# EAGLE design switch (EAGLE 6.6.0)
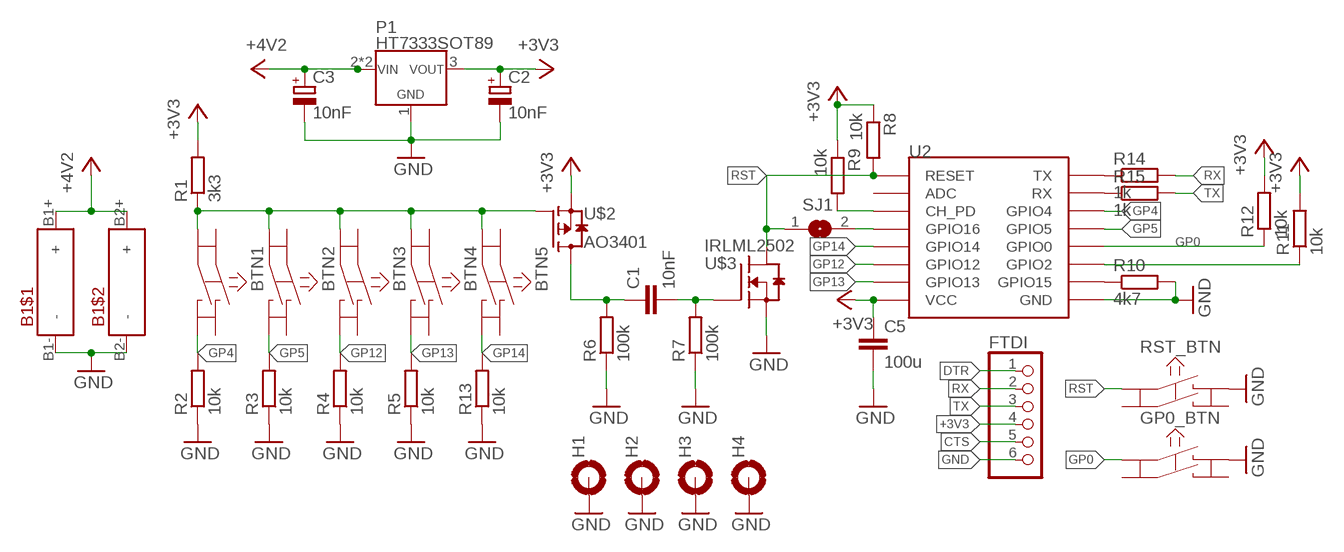
[diagram p0: schematic, sheet 1]

## Parts
B1  18650_2X  [18650_HOLDER]
BTN1  KSM611A  [KSM611A]
BTN2  KSM611A  [KSM611A]
BTN3  KSM611A  [KSM611A]
BTN4  KSM611A  [KSM611A]
BTN5  KSM611A  [KSM611A]
C1  10nF  C-EU025-025X050  [C025-025X050]
C2  10nF  CPOL-EUE5-8.5  [E5-8,5]
C3  10nF  CPOL-EUE5-8.5  [E5-8,5]
C5  100u  C-EUC1206  [C1206]
FTDI  PINHD-1X06_2.54-S  [1X06-S]
GP0_BTN  KSM611A  [KSM611A]
H1  MOUNT-PAD-ROUND3.2  [3,2-PAD]
H2  MOUNT-PAD-ROUND3.2  [3,2-PAD]
H3  MOUNT-PAD-ROUND3.2  [3,2-PAD]
H4  MOUNT-PAD-ROUND3.2  [3,2-PAD]
P1  HT7333SOT89  [SOT89]
R1  3k3  R-EU_MULTI  [MULTI_RESISTOR]
R2  10k  R-EU_MULTI  [MULTI_RESISTOR]
R3  10k  R-EU_MULTI  [MULTI_RESISTOR]
R4  10k  R-EU_MULTI  [MULTI_RESISTOR]
R5  10k  R-EU_MULTI  [MULTI_RESISTOR]
R6  100k  R-EU_MULTI  [MULTI_RESISTOR]
R7  100k  R-EU_MULTI  [MULTI_RESISTOR]
R8  10k  R-EU_MULTI  [MULTI_RESISTOR]
R9  10k  R-EU_MULTI  [MULTI_RESISTOR]
R10  4k7  R-EU_MULTI  [MULTI_RESISTOR]
R11  10k  R-EU_MULTI  [MULTI_RESISTOR]
R12  10k  R-EU_MULTI  [MULTI_RESISTOR]
R13  10k  R-EU_MULTI  [MULTI_RESISTOR]
R14  1k  R-EU_MULTI  [MULTI_RESISTOR]
R15  1k  R-EU_MULTI  [MULTI_RESISTOR]
RST_BTN  KSM611A  [KSM611A]
SJ1  SJ  [SJ]
U2  ESP12SMD  [ESP12-SMD]
U$2  AO3401  P-CH_AO3401  [SOT23]
U$3  IRLML2502  N-CH_IRLML2502  [SOT23]

## Nets
+3V3: C2.+ C5.1 FTDI.4 P1.3(VOUT) R1.2@1 R1.2@2 R8.1@1 R8.1@2 R9.1@1 R9.1@2 R11.2@1 R11.2@2 R12.2@1 R12.2@2 U2.VCC U$2.2(S)
+5V: B1.B1+($1:+) B1.B2+($2:+) C3.+ P1.2(VIN) P1.2@1(VIN) ; supply symbol labelled +4V2
CTS: FTDI.5
DTR: FTDI.1
GND: B1.B1-($1:-) B1.B2-($2:-) C2.- C3.- C5.2 FTDI.6 GP0_BTN.B H1.B3,2(MOUNT) H2.B3,2(MOUNT) H3.B3,2(MOUNT) H4.B3,2(MOUNT) P1.1(GND) R2.1@1 R2.1@2 R3.1@1 R3.1@2 R4.1@1 R4.1@2 R5.1@1 R5.1@2 R6.1@1 R6.1@2 R7.1@1 R7.1@2 R10.2@1 R10.2@2 R13.1@1 R13.1@2 RST_BTN.B U2.GND U$3.2(S)
GP0: GP0_BTN.A R12.1@1 R12.1@2 U2.GPIO0
GP4: BTN1.D R2.2@1 R2.2@2 U2.GPIO4
GP5: BTN2.D R3.2@1 R3.2@2 U2.GPIO5
GP12: BTN3.D R4.2@1 R4.2@2 U2.GPIO12
GP13: BTN4.D R5.2@1 R5.2@2 U2.GPIO13
GP14: BTN5.D R13.2@1 R13.2@2 U2.GPIO14
N$1: SJ1.2 U2.GPIO16
N$2: R9.2@1 R9.2@2 U2.CH_PD
N$3: C1.2 R7.2@1 R7.2@2 U$3.1(G)
N$4: R10.1@1 R10.1@2 U2.GPIO15
N$5: R11.1@1 R11.1@2 U2.GPIO2
N$6: R14.1@1 R14.1@2 U2.TXD0(TX)
N$7: C1.1 R6.2@1 R6.2@2 U$2.3(D)
N$8: BTN1.C BTN2.C BTN3.C BTN4.C BTN5.C R1.1@1 R1.1@2 U$2.1(G)
N$9: R15.1@1 R15.1@2 U2.RXD0(RX)
RST: R8.2@1 R8.2@2 RST_BTN.A SJ1.1 U2.RESET U$3.3(D)
RX: FTDI.2 R14.2@1 R14.2@2
TX: FTDI.3 R15.2@1 R15.2@2
Unconnected: BTN1.A BTN1.B BTN2.A BTN2.B BTN3.A BTN3.B BTN4.A BTN4.B BTN5.A BTN5.B GP0_BTN.C GP0_BTN.D RST_BTN.C RST_BTN.D U2.ADC

## Library data of the parts
B1 = diyHue:18650_2X
BTN1-BTN5 GP0_BTN RST_BTN = schalter_taster:KSM611A
C1 C5 = rcl:C-EU: CAPACITOR, European symbol
C2 C3 = rcl:CPOL-EU: POLARIZED CAPACITOR, European symbol
FTDI = pinhead-2:PINHD-1X06: PIN HEADER
H1-H4 = holes:MOUNT-PAD-ROUND: MOUNTING PAD, round
P1 = diyHue:HT7333
R1-R15 = diyHue:R-EU_MULTI
SJ1 = jumper:SJ: SMD solder JUMPER
U2 = esp8266modules:ESP12: ESP8266 Wifi module 12
U$2 = diyHue:P-CH_AO3401
U$3 = diyHue:N-CH_IRLML2502

## Board
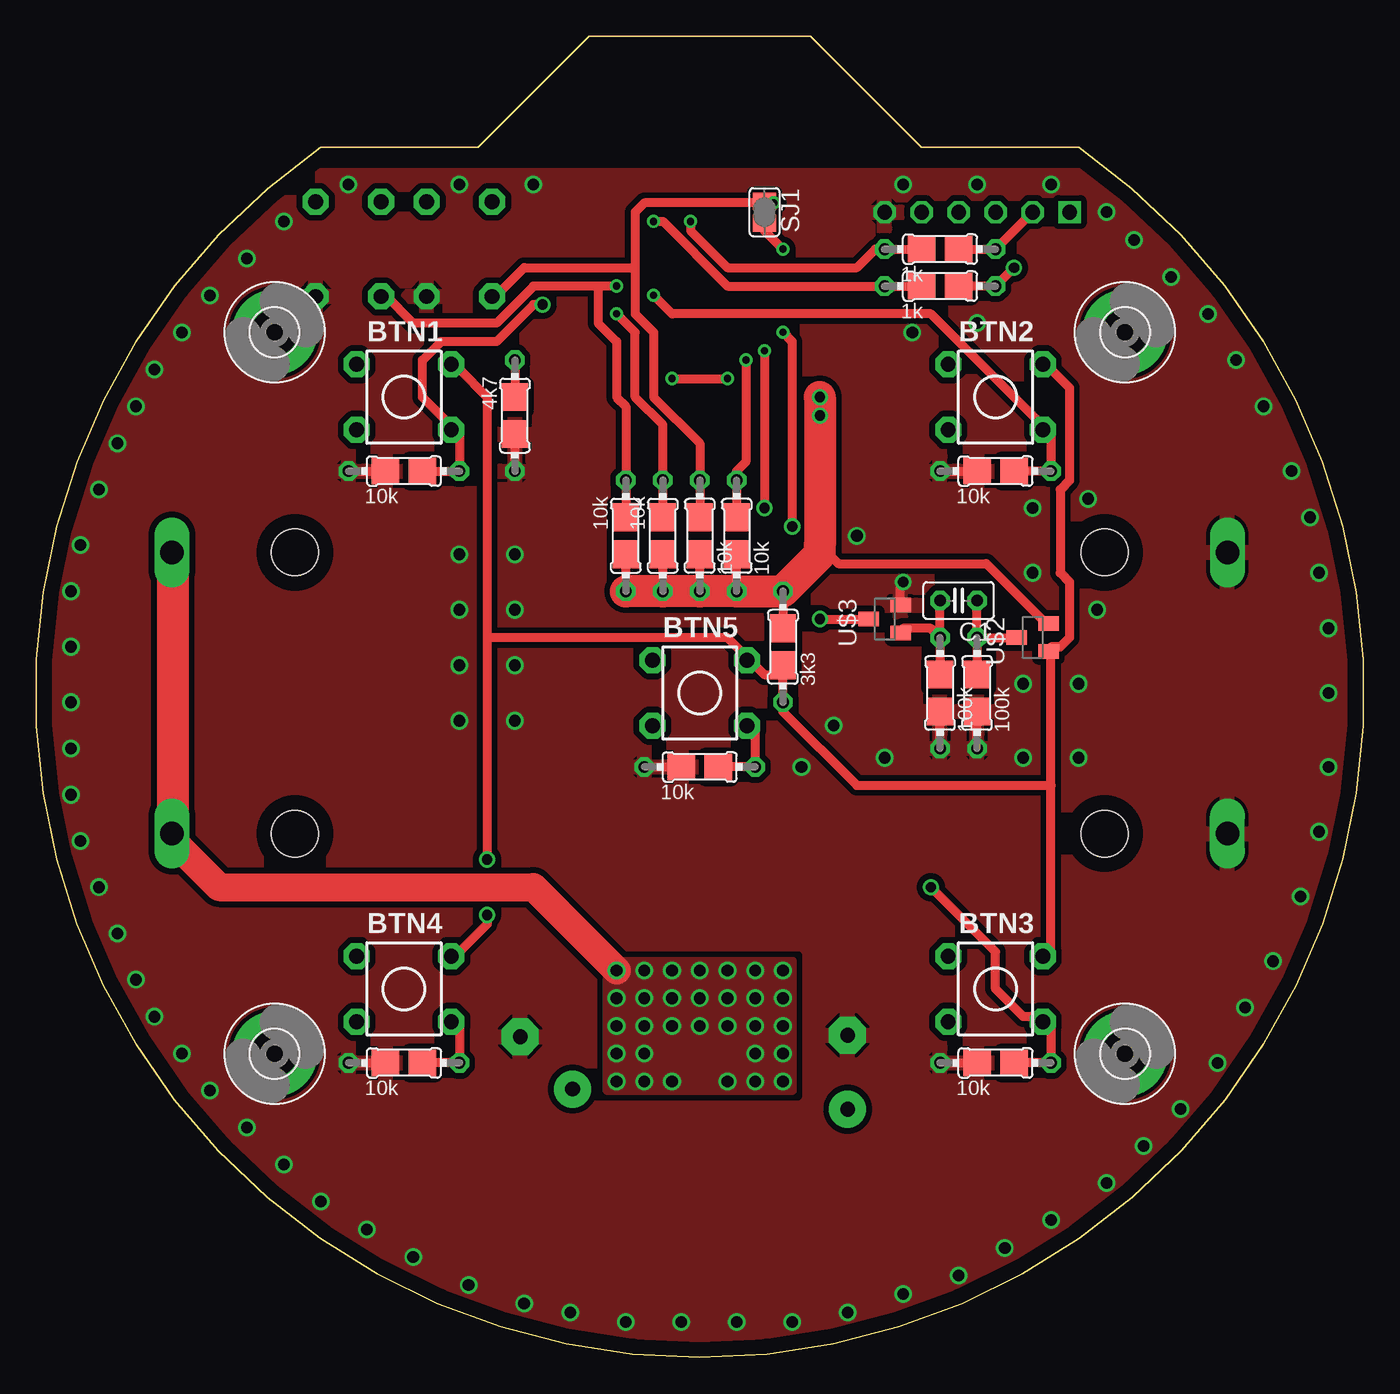
[diagram p1: board, top side]
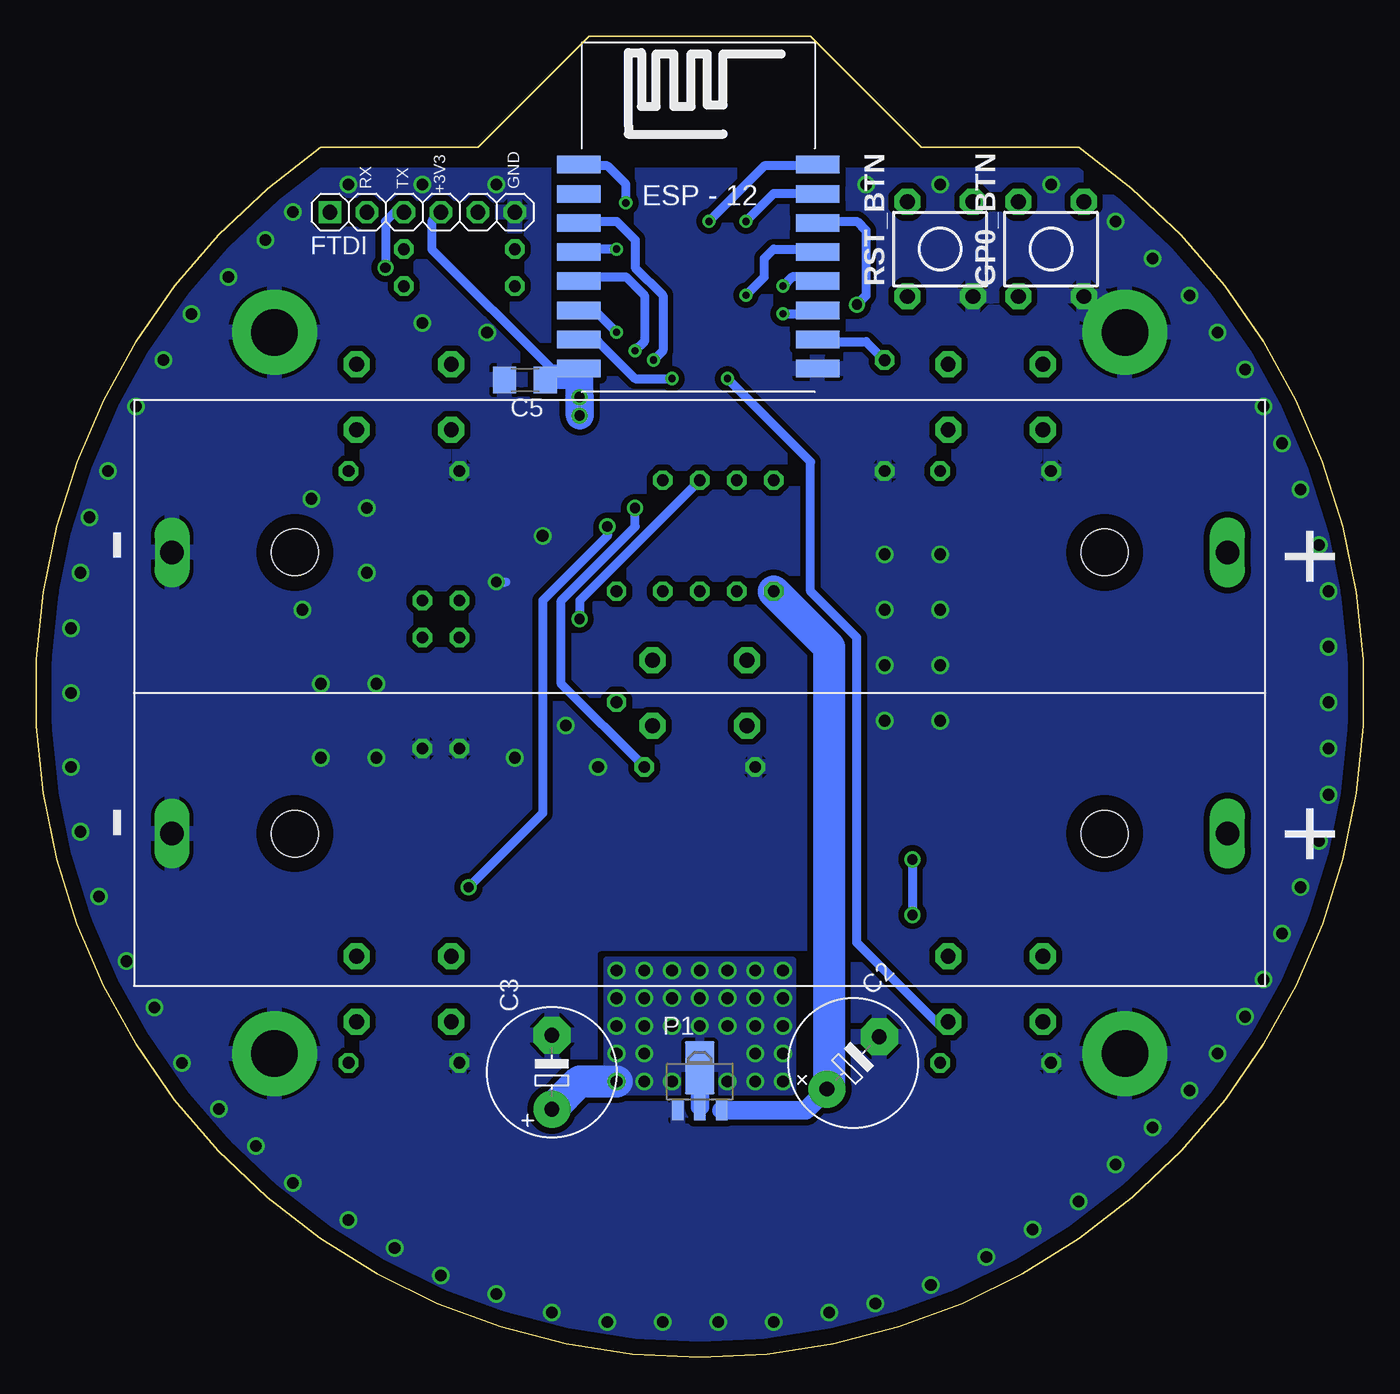
[diagram p2: board, bottom side, seen from below]

Size 91.13 x 90.71 mm. Coordinates in mm from the lower left corner, seen from the top.
Outline: 19.53,83.09 arc290 71.6,83.09 60.81,83.09 53.19,90.71 37.95,90.71 30.33,83.09 19.53,83.09
Copper layers (1*16): Top 0.035mm / dielectric 1.5mm / Bottom 0.035mm
Design rules "default *": minimum track width 10mil, minimum drill 0.5mm, track to track 8mil, track to pad 8mil, pad to pad 8mil, via to via 8mil, smd to smd 0mil, copper to edge 40mil, drill to drill 8mil, minimum pad ring 10mil, minimum via ring 8mil, stop-mask expansion 4mil, vias tented up to drill 50mil, thermal gap 10mil

### Footprints (pad centres in the part's own frame; a part is rotated, then mirrored left to right if it is on the bottom)
18650_HOLDER = drill 1.6 long: B1+ 36.25,9.65; B1- -36.25,9.65; B2+ 36.25,-9.65; B2- -36.25,-9.65 | hole 3.2: -27.81,9.65; 27.81,9.65; 27.81,-9.65; -27.81,-9.65
KSM611A = drill 1.016 pad 1.778 octagon: A -3.25,2.25; B -3.25,-2.25; C 3.25,2.25; D 3.25,-2.25
C025-025X050 = drill 0.813 octagon: 1 -1.27,0; 2 1.27,0
E5-8,5 = drill 1.016 pad 2.54: + -2.54,0 | drill 1.016 pad 2.54 octagon: - 2.54,0
C1206 = smd 1.6 x 1.8: 1 -1.4,0; 2 1.4,0
1X06-S = drill 1.016 square: 1 -6.35,0 | drill 1.016 octagon: 2 -3.81,0; 3 -1.27,0; 4 1.27,0; 5 3.81,0; 6 6.35,0
3,2-PAD = drill 3.2 pad 5.842: B3,2 0,0
SOT89 = smd 0.8 x 1.4: 1 -1.499,-1.981; 3 1.499,-1.981 | smd 0.8 x 1.9: 2 0,-1.727 | smd 2.032 x 3.65: 2@1 0,0.94
MULTI_RESISTOR = drill 0.813 octagon: 1@1 -3.81,0; 2@1 3.81,0 | smd 1.905 x 1.803: 1@2 -1.266,0; 2@2 1.266,0
SJ = smd 1.168 x 1.6: 1 -0.762,0; 2 0.762,0
ESP12-SMD = smd 3 x 1.2: ADC -8.3,3.8; CH_PD -8.3,1.8; GND 8.1,-8.2; GPIO0 8.1,-2.2; GPIO2 8.1,-4.2; GPIO4 8.1,1.8; GPIO5 8.1,-0.2; GPIO12 -8.3,-4.2; GPIO13 -8.3,-6.2; GPIO14 -8.3,-2.2; GPIO15 8.1,-6.2; GPIO16 -8.3,-0.2; RESET -8.3,5.8; RXD0 8.1,3.8; TXD0 8.1,5.8; VCC -8.3,-8.2
SOT23 = smd 1 x 1.4: 1 -0.95,-1.1; 2 0.95,-1.1; 3 0,1.1

### Placement (x,y rotation side)
B1  45.57,45.62 0 bottom
BTN1  25.25,65.94 0 top
BTN2  65.89,65.94 0 top
BTN3  65.89,25.3 0 top
BTN4  25.25,25.3 0 top
BTN5  45.57,45.62 0 top
C1  63.35,51.97 180 top
C2  35.03,20.22 45 bottom
C3  55.73,19.59 90 bottom
C5  57.57,67.12 180 bottom
FTDI  64.62,78.64 0 bottom
GP0_BTN  21.44,76.1 90 bottom
H1  16.36,20.86 0 top
H2  74.78,20.86 0 top
H3  74.78,70.39 0 top
H4  16.36,70.39 0 top
P1  45.57,18.95 0 bottom
R1  51.28,48.8 90 top
R2  25.25,60.86 0 top
R3  65.89,60.86 0 top
R4  65.89,20.22 0 top
R5  25.25,20.22 0 top
R6  64.62,45.62 90 top
R7  62.08,45.62 90 top
R8  45.57,56.42 90 top
R9  48.11,56.42 90 top
R10  32.87,64.67 270 top
R11  43.03,56.42 270 top
R12  40.49,56.42 270 top
R13  45.57,40.54 0 top
R14  62.08,76.1 0 top
R15  62.08,73.56 0 top
RST_BTN  29.06,76.1 90 bottom
SJ1  50.01,78.64 270 top
U2  45.57,76.1 0 bottom
U$2  68.43,49.43 90 top
U$3  58.27,50.7 90 top

### Tracks (layer width: path | path; a pad name or v marks a point on that pad's centre or on a via)
+3V3  (via drill 0.7)
  Top 0.61: R9.1@1 R9.1@2 | R8.1@1 R8.1@2 | R12.2@1 R12.2@2 | R11.2@1 R11.2@2 | U$2.2 69.06,50.7 65.25,54.51 55.09,54.51 53.82,55.78 | R1.2@1 R1.2@2
  Top 2.184: R12.2@1 R11.2@1 R8.1@1 R9.1@1 R1.2@1 53.82,55.15 53.82,55.78 v53.82,65.94
  Bottom 0.61: U2.VCC 54.46,67.85 55.73,67.85 63.98,76.1 63.98,78.01 FTDI.4
  Bottom 1.27: U2.VCC 53.87,67.26 | C5.1 53.82,67.11 v53.82,65.94 53.82,65.85 | P1.3 38.28,16.97 C2.+
  Bottom 1.93: 53.87,67.26 v53.82,64.67 v53.82,65.94
  Bottom 2.184: R12.2@1 36.68,48.8 36.68,18.95 C2.+
+5V  (via drill 0.8)
  Top 1.93: v39.85,26.57 34.14,32.29 12.55,32.29 9.37,35.46 B1.B2+
  Top 2.184: B1.B2+ 9.37,36.73 9.37,55.15 B1.B1+
  Bottom 1.27: P1.2 P1.2@1
  Bottom 2.184: v51.28,18.95 53.82,18.95 C3.+
  other vias: 47.47,18.95 43.66,18.95 43.66,22.76 45.57,22.76 47.47,22.76 47.47,24.67 45.57,24.67 43.66,24.67 43.66,26.57 41.76,26.57 45.57,26.57 47.47,26.57 49.38,26.57 51.28,26.57 51.28,24.67 49.38,24.67 49.38,22.76 51.28,22.76 51.28,20.86 49.38,20.86 49.38,18.95 41.76,24.67 39.85,24.67 39.85,22.76 41.76,22.76 41.76,20.86 39.85,20.86 39.85,18.95 41.76,18.95
  pour Bottom: 39.22,27.21 51.92,27.21 51.92,18.32 39.22,18.32
  pour Top: 39.22,27.21 51.92,27.21 51.92,18.32 39.22,18.32
GND  (via drill 0.7, 0.8)
  Top 0.61: R10.2@1 R10.2@2 | R6.1@1 R6.1@2 | R7.1@1 R7.1@2 | U$3.2 59.37,53.07 v59.54,53.24 | R2.1@1 R2.1@2 | R3.1@1 R3.1@2 | R4.1@1 R4.1@2 | R5.1@1 R5.1@2 | R13.1@1 R13.1@2
  Bottom 0.61: v59.54,53.24 58.9,53.24
  other vias: 16.99,78.01 14.45,75.47 11.91,72.93 10.01,70.39 8.1,67.85 6.83,65.31 5.56,62.77 4.29,59.59 3.02,55.78 2.39,52.61 2.39,48.8 2.39,44.99 2.39,41.81 2.39,38.64 3.02,35.46 4.29,32.29 5.56,29.11 6.83,25.94 8.1,23.4 10.01,20.86 11.91,18.32 14.45,15.78 16.99,13.24 19.53,10.7 22.71,8.79 25.88,6.89 29.69,4.98 33.5,3.71 36.68,3.08 40.49,2.44 44.3,2.44 48.11,2.44 51.92,2.44 55.73,3.08 59.54,4.35 63.35,5.62 66.52,7.52 69.7,9.43 73.51,11.97 76.05,14.51 78.59,17.05 81.13,20.22 83.03,24.03 84.94,27.21 86.84,31.65 88.11,36.1 88.75,40.54 88.75,45.62 88.75,50.07 88.11,53.88 87.48,57.69 86.21,60.86 84.3,65.31 82.4,68.48 80.49,71.66 77.95,74.2 75.41,76.74 73.51,78.64 69.7,80.55 64.62,80.55 59.54,80.55 34.14,80.55 29.06,80.55 21.44,80.55 32.87,51.34 32.87,55.15 29.06,55.15 29.06,51.34 32.87,47.53 32.87,43.72 29.06,47.53 29.06,43.72 67.79,46.26 67.79,41.18 58.27,41.18 60.17,70.39 68.43,58.32 68.43,53.88 56.36,56.42 72.24,58.96 64.62,71.02 72.87,51.34 71.6,46.26 71.6,41.18 54.77,43.4 52.55,40.54
  pour Bottom (isolate 0.406, rank 6): -3.96,81.18 93.83,81.18 93.83,-5.18 -3.96,-5.18
  pour Top (isolate 0.406, rank 6): -3.96,81.18 93.83,81.18 93.83,-5.18 -3.96,-5.18
GP0  (via drill 0.5)
  Top 0.61: R12.1@2 R12.1@1 40.49,65.31 39.85,65.94 39.85,69.75 38.58,71.02 38.58,73.56 | GP0_BTN.A 23.98,72.93 25.88,71.02 31.6,71.02 34.14,73.56 38.58,73.56 | v39.85,73.56 38.58,73.56
  Bottom 0.61: v39.85,73.56 39.22,74.2 37.95,74.2 U2.GPIO0
GP4  (via drill 0.7)
  Top 0.61: R2.2@2 R2.2@1 29.06,63.4 BTN1.D 28.42,64.04 26.52,65.94 26.52,68.48 27.79,69.75 31.6,69.75 34.14,72.29 v34.77,72.29
  Bottom 0.61: v34.77,72.29 34.14,72.93 34.14,77.37 34.77,78.01 37.31,78.01 U2.GPIO4
GP5  (via drill 0.5)
  Top 0.61: R3.2@2 R3.2@1 69.7,63.4 BTN2.D 69.06,64.04 61.44,71.66 43.66,71.66 v42.39,72.93
  Bottom 0.61: v42.39,72.93 41.12,74.2 41.12,75.47 40.49,76.1 37.95,76.1 U2.GPIO5
GP12  (via drill 0.5, 0.7)
  Top 0.61: R4.2@2 R4.2@1 69.7,22.76 BTN3.D 69.06,23.4 67.79,23.4 65.89,25.3 65.89,27.84 v61.44,32.29 | v51.92,57.05 51.92,69.75 v51.28,70.39
  Bottom 0.61: v61.44,32.29 56.36,37.37 56.36,51.97 51.92,56.42 v51.92,57.05 | v51.28,70.39 52.55,71.66 53.82,71.66 U2.GPIO12
GP13  (via drill 0.5)
  Top 0.61: R5.2@2 R5.2@1 29.06,22.76 BTN4.D | v43.66,67.21 v47.47,67.21
  Bottom 0.61: v47.47,67.21 50.01,67.21 52.55,69.75 | 52.55,69.75 53.82,69.75 U2.GPIO13 52.55,69.75 | v43.66,67.21 37.95,61.5 37.95,52.61 34.77,49.43 34.77,28.48 29.06,22.76 BTN4.D
GP14  (via drill 0.5, 0.7)
  Top 0.61: R13.2@2 R13.2@1 49.38,43.08 BTN5.D | v50.01,69.12 v50.01,58.32
  Bottom 0.61: R13.2@1 55.09,46.26 55.09,51.97 50.01,57.05 v50.01,58.32 | v50.01,69.12 49.38,69.75 49.38,72.93 50.65,74.2 53.82,74.2 U2.GPIO14
N$1  (via drill 0.5)
  Top 0.61: v51.28,76.1 50.01,77.37 SJ1.2
  Bottom 0.61: v51.28,76.1 53.82,76.1 U2.GPIO16
N$2  (via drill 0.5)
  Top 0.61: R9.2@2 R9.2@1 48.11,60.86 48.74,61.5 v48.74,68.48
  Bottom 0.61: v48.74,68.48 48.11,69.12 48.11,72.93 50.01,74.83 50.01,76.74 51.28,78.01 53.82,78.01 U2.CH_PD
N$3
  Top 0.61: R7.2@1 61.44,50.07 59.54,50.07 U$3.1 | R7.2@1 C1.2 | R7.2@1 R7.2@2
N$4
  Top 0.61: R10.1@1 R10.1@2
  Bottom 0.61: 37.95,69.75 U2.GPIO15 37.31,69.75 34.14,69.75 R10.1@1
N$5  (via drill 0.5)
  Top 0.61: R11.1@2 R11.1@1 43.03,60.86 43.03,64.04 41.12,65.94 41.12,70.39 v39.85,71.66
  Bottom 0.61: v39.85,71.66 37.95,71.66 U2.GPIO2
N$6  (via drill 0.5)
  Top 0.61: R14.1@2 R14.1@1 57.63,76.1 56.36,74.83 47.47,74.83 44.93,77.37 v44.93,78.01
  Bottom 0.61: v44.93,78.01 41.12,81.82 37.95,81.82 U2.TXD0
N$7
  Top 0.61: R6.2@1 C1.1 | R6.2@1 U$2.3 | R6.2@1 R6.2@2
N$8  (via drill 0.7)
  Top 0.61: 51.28,46.89 R1.1@1 51.28,44.35 56.36,39.27 69.7,39.27 | 51.28,46.89 50.01,46.89 49.38,47.53 BTN5.C 48.74,48.16 47.47,49.43 30.96,49.43 | 51.28,46.89 R1.1@2 | 30.96,49.43 30.96,65.94 29.06,67.85 BTN1.C | 30.96,49.43 v30.96,34.19 | v30.96,30.38 30.96,29.75 29.06,27.84 BTN4.C | BTN2.C 69.7,67.85 70.97,66.58 70.97,60.23 70.33,59.59 70.33,53.88 70.97,53.24 70.97,49.43 70.33,48.8 69.7,48.8 U$2.1 69.7,48.16 69.7,39.27 | 69.7,39.27 69.7,27.84 BTN3.C
  Bottom 0.61: v30.96,34.19 v30.96,30.38
N$9  (via drill 0.5)
  Top 0.61: R15.1@2 R15.1@1 47.47,73.56 43.03,78.01 v42.39,78.01
  Bottom 0.61: v42.39,78.01 40.49,79.91 37.95,79.91 U2.RXD0
RST  (via drill 0.5, 0.7)
  Top 0.61: 50.01,79.28 v50.65,79.28 | R8.2@2 R8.2@1 45.57,62.77 42.39,65.94 42.39,70.39 41.12,71.66 41.12,74.83 | v53.82,50.7 U$3.3 | 41.12,74.83 41.12,78.64 41.76,79.28 50.01,79.28 | 50.01,79.28 SJ1.1 | 41.12,74.83 33.5,74.83 31.6,72.93 RST_BTN.A
  Bottom 0.61: v50.65,79.28 50.65,80.55 51.92,81.82 53.82,81.82 U2.RESET | v53.82,50.7 53.82,51.97 R8.2@1
RX
  Top 0.61: R14.2@2 R14.2@1 FTDI.2
TX  (via drill 0.7)
  Top 0.61: R15.2@2 R15.2@1 v67.16,74.83
  Bottom 0.61: v67.16,74.83 67.16,78.01 66.52,78.64 FTDI.3

### Text on the board
bPlace: GND | TX | RX | +3V3